# EAGLE design ACtoDCconvtr (EAGLE 6.5.0)
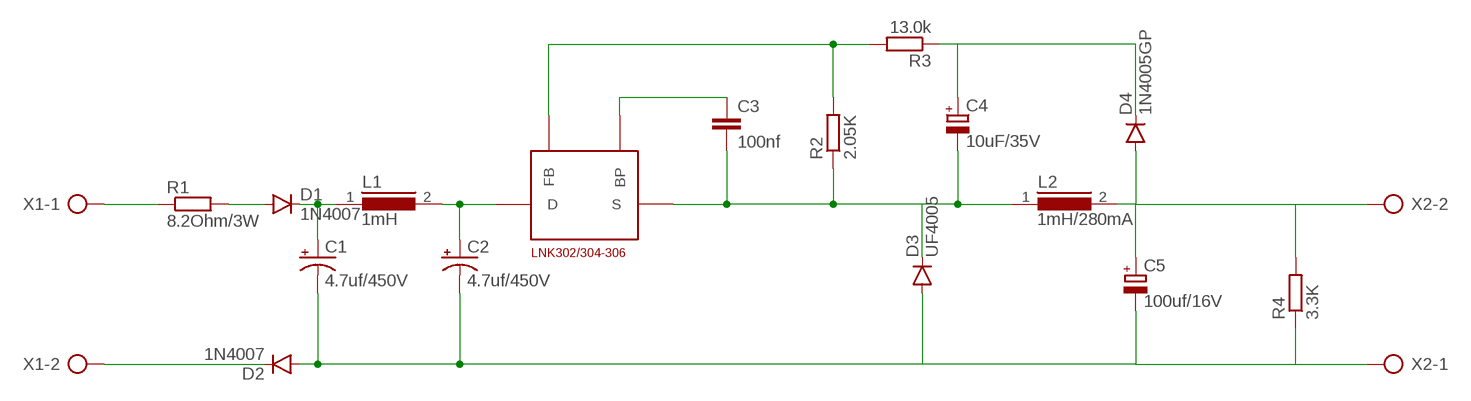
[diagram p0: schematic, sheet 1]

## Parts
C1  4.7uf/450V  1000UF-25V(PTH)KIT  [CPOL-RADIAL-1000UF-25V-KIT]
C2  4.7uf/450V  1000UF-25V(PTH)KIT  [CPOL-RADIAL-1000UF-25V-KIT]
C3  100nf  C2.5/4  [C2.5-4]
C4  10uF/35V  CPOL-EUE2.5-5  [E2,5-5]
C5  100uf/16V  CPOL-EUE2.5-7  [E2,5-7]
D1  1N4007  DIODEKIT  [DIODE-1N4148-KIT]
D2  1N4007  DIODEKIT  [DIODE-1N4148-KIT]
D3  UF4005  DIODEKIT  [DIODE-1N4148-KIT]
D4  1N4005GP  DIODEKIT  [DIODE-1N4148-KIT]
L1  1mH  82114R  [82114R]
L2  1mH/280mA  82114R  [82114R]
R1  8.2Ohm/3W  R-EU_0411/15  [0411/15]
R2  2.05K  R-EU_0207/2V  [0207/2V]
R3  13.0k  R-EU_0207/2V  [0207/2V]
R4  3.3K  R-EU_0207/10  [0207/10]
U$1  LNK302/304-306  [SMD-8B]
X1  AK300/2  [AK300/2]
X2  AK300/2  [AK300/2]

## Nets
N$1: R1.1 X1.1
N$2: D1.A R1.2
N$3: C1.+ D1.C L1.1
N$4: C2.+ L1.2 U$1.D
N$5: D2.C X1.2
N$6: C1.- C2.- C5.- D2.A D3.A R4.1 X2.1
N$7: C3.2 C4.- D3.C L2.1 R2.1 U$1.S1(S)
N$8: C3.1 U$1.BP
N$9: R2.2 R3.2 U$1.FB
N$10: C4.+ D4.C R3.1
N$11: C5.+ D4.A L2.2 R4.2 X2.2

## Library data of the parts
C1 C2 = SparkFun-Capacitors:1000UF-25V(PTH): CAP-08070; PROD_ID: CAP-09538; VALUE: 1000uf/25V
C3 = capacitor-wima:C: CAPACITOR naming: grid - package width
C4 C5 = rcl:CPOL-EU: POLARIZED CAPACITOR, European symbol
D1-D4 = SparkFun-DiscreteSemi:DIODE: Diode These are standard reverse protection diodes and small signal diodes. SMA package can handle up to about 1A. SOD-323 can handle about 200mA. What the SOD-323 package when ordering, there are some mfgs out there that are 5-pin packages.
L1 L2 = inductors:82114R: INDUCTOR
R1-R4 = rcl:R-EU_: RESISTOR, European symbol
U$1 = linkswitch:LNK302/304-306
X1 X2 = con-ptr500:AK300/2: CONNECTOR; OC_FARNELL: unknown; OC_NEWARK: unknown

## Board
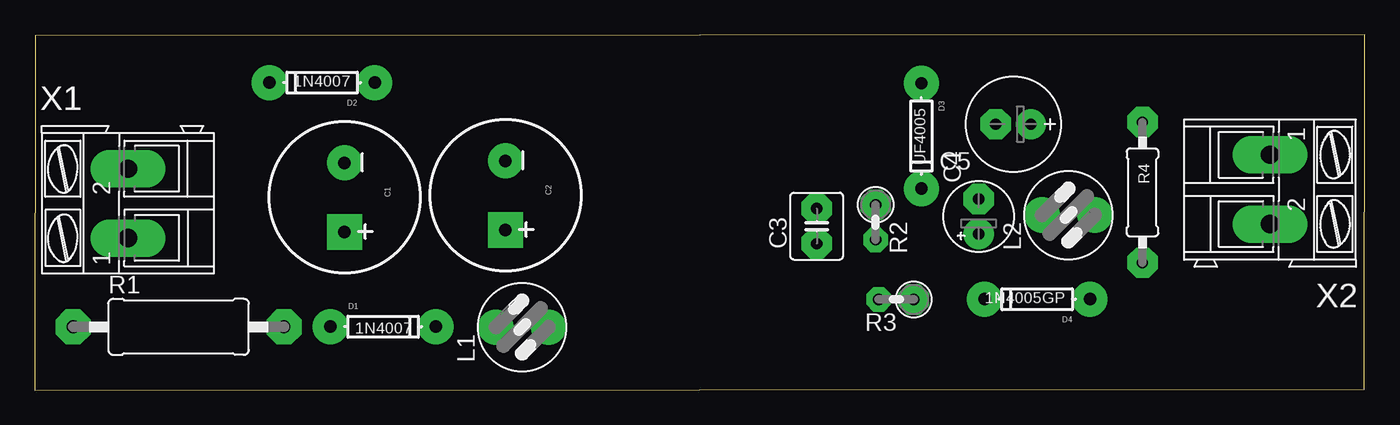
[diagram p1: board, top side]
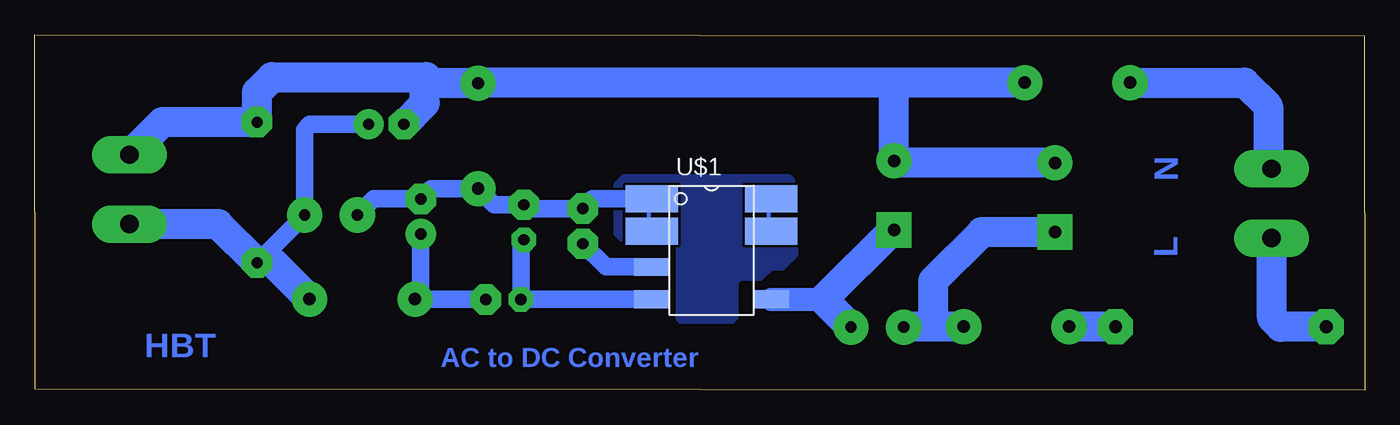
[diagram p2: board, bottom side, seen from below]

Size 96.17 x 25.71 mm. Coordinates in mm from the lower left corner, seen from the top.
Outline: 0,0 96.14,0.07 96.17,25.71 0.03,25.65 0,0
Copper layers (1*16): Top 0.035mm / dielectric 1.5mm / Bottom 0.035mm
Design rules "default": minimum track width 10mil, minimum drill 24mil, track to track 8mil, track to pad 8mil, pad to pad 8mil, via to via 8mil, smd to smd 8mil, copper to edge 40mil, drill to drill 8mil, minimum pad ring 10mil, minimum via ring 8mil, stop-mask expansion 4mil, vias tented up to drill 0mil, thermal gap 10mil

### Footprints (pad centres in the part's own frame; a part is rotated, then mirrored left to right if it is on the bottom)
CPOL-RADIAL-1000UF-25V-KIT = drill 0.9 pad 2.54 square: + 2.5,0 | drill 0.9 pad 2.54: - -2.5,0
C2.5-4 = drill 0.813 pad 2.184 octagon: 1 -1.27,0; 2 1.27,0
E2,5-5 = drill 0.813 pad 2.184: + -1.27,0 | drill 0.813 pad 2.184 octagon: - 1.27,0
E2,5-7 = drill 0.813 pad 2.184: + -1.27,0 | drill 0.813 pad 2.184 octagon: - 1.27,0
DIODE-1N4148-KIT = drill 0.9 pad 2.54: A -3.81,0; C 3.81,0
82114R = drill 0.813 pad 2.54: 1 0,1.905; 2 0,-1.905
0411/15 = drill 0.914 pad 2.54 octagon: 1 -7.62,0; 2 7.62,0
0207/2V = drill 0.813 pad 2.184 octagon: 1 -1.27,0 | drill 0.813 pad 1.778 octagon: 2 1.27,0
0207/10 = drill 0.8 pad 2.184 octagon: 1 -5.08,0; 2 5.08,0
SMD-8B = smd 2.54 x 1.27: BP -4.318,-1.194; D 4.318,-3.537; FB -4.318,-3.537 | smd 3.81 x 1.93: S1 -4.318,3.728; S2 -4.318,1.372; S3 4.318,1.372; S4 4.318,3.728
AK300/2 = drill 1.321 pad 2.7 long: 1 -2.515,0; 2 2.489,0

### Placement (x,y rotation side)
C1  22.41,13.94 270 top
C2  34.04,14.09 270 top
C3  56.54,11.87 90 top
C4  68.25,12.57 90 top
C5  70.75,19.24 180 top
D1  25.2,4.6 0 top
D2  20.78,22.24 180 top
D3  64.11,18.39 270 top
D4  72.48,6.59 180 top
L1  35.25,4.58 90 top
L2  74.74,12.67 90 top
R1  10.41,4.6 0 top
R2  60.8,12.15 270 top
R3  62.29,6.58 180 top
R4  80.09,14.31 270 top
U$1  47.23,10.12 0 bottom
X1  6.74,13.53 90 top
X2  89.3,14.51 270 top

### Tracks (layer width: path | path; a pad name or v marks a point on that pad's centre or on a via)
N$1
  Bottom 1.27: 6.73,11 X1.1
  Bottom 2.184: R1.1 6.09,4.6 6.73,5.24 6.73,11
N$2
  Bottom 1.27: D1.A
  Bottom 2.184: R1.2 D1.A
N$3
  Bottom 1.27: 33.32,4.6 L1.1
  Bottom 2.184: D1.C 31.22,4.6 | 31.22,4.6 33.32,4.6 | C1.+ 27.7,11.44 31.22,7.92 31.22,4.6
N$4
  Bottom 1.27: C2.+ 34.16,11.59
  Bottom 1.676: U$1.D 39.16,6.59
  Bottom 2.184: L1.2 39.16,6.59 34.16,11.59
N$5
  Bottom 1.27: 7,16.27 X1.2
  Bottom 2.184: D2.C 8.71,22.24 7,20.53 7,16.27
N$6
  Bottom 1.27: 64.06,22.24 D3.A | 33.89,16.44 C2.- | 67.96,22.2 67.4,22.2 67.83,22.63
  Bottom 1.676: 34.04,21.28 35,22.24
  Bottom 2.184: D2.A 35,22.24 64.06,22.24 | C2.- 34.04,21.28 | C1.- 33.89,16.44 | D3.A 67.4,22.2 | 67.83,22.63 79.01,22.63 80.09,21.55 R4.1 86.94,19.39 X2.1 | C5.- 67.96,20.75 67.96,22.2
N$7
  Bottom 1.27: L2.1 71.66,13.84 C4.- 67.51,14.58 D3.C 62.95,13.42 R2.1 60.52,13.14 C3.2 55.83,13.85 U$1.S1
N$8
  Bottom 1.27: C3.1 54.87,8.93 U$1.BP
N$9
  Bottom 1.27: R2.2 61.02,10.66 R3.2 61.01,6.59 U$1.FB
N$10
  Bottom 1.27: R3.1 63.57,6.59 D4.C 68.25,7.01 C4.+
N$11
  Bottom 1.27: 78.93,9.23 R4.2 L2.2 76.66,12.69 76.66,18.85 76.27,19.24 C5.+
  Bottom 2.184: D4.A 78.93,9.23 | R4.2 82.88,12.02 X2.2
N$12
  pour Bottom: 43.22,8.5 43.68,8.04 45.18,8.04 45.45,7.77 45.45,5.24 45.75,4.93 49.48,4.93 49.67,5.12 49.67,10.54 49.98,10.85 53.74,10.85 54.17,11.27 54.17,14.88 53.55,15.5 41.64,15.5 41.15,15 41.15,9.73 42.09,8.79 42.89,8.79 43.16,8.51 43.22,8.51
N$13
  Bottom 0.305: 42.95,11.35 43.07,11.46 43.07,14
N$14
  Bottom 0.305: 51.71,11.77 51.75,11.81 51.75,13.88

### Text on the board
Bottom: N | L | HBT | AC to DC Converter